# EAGLE design RasPi-feather (EAGLE 8.4.0)
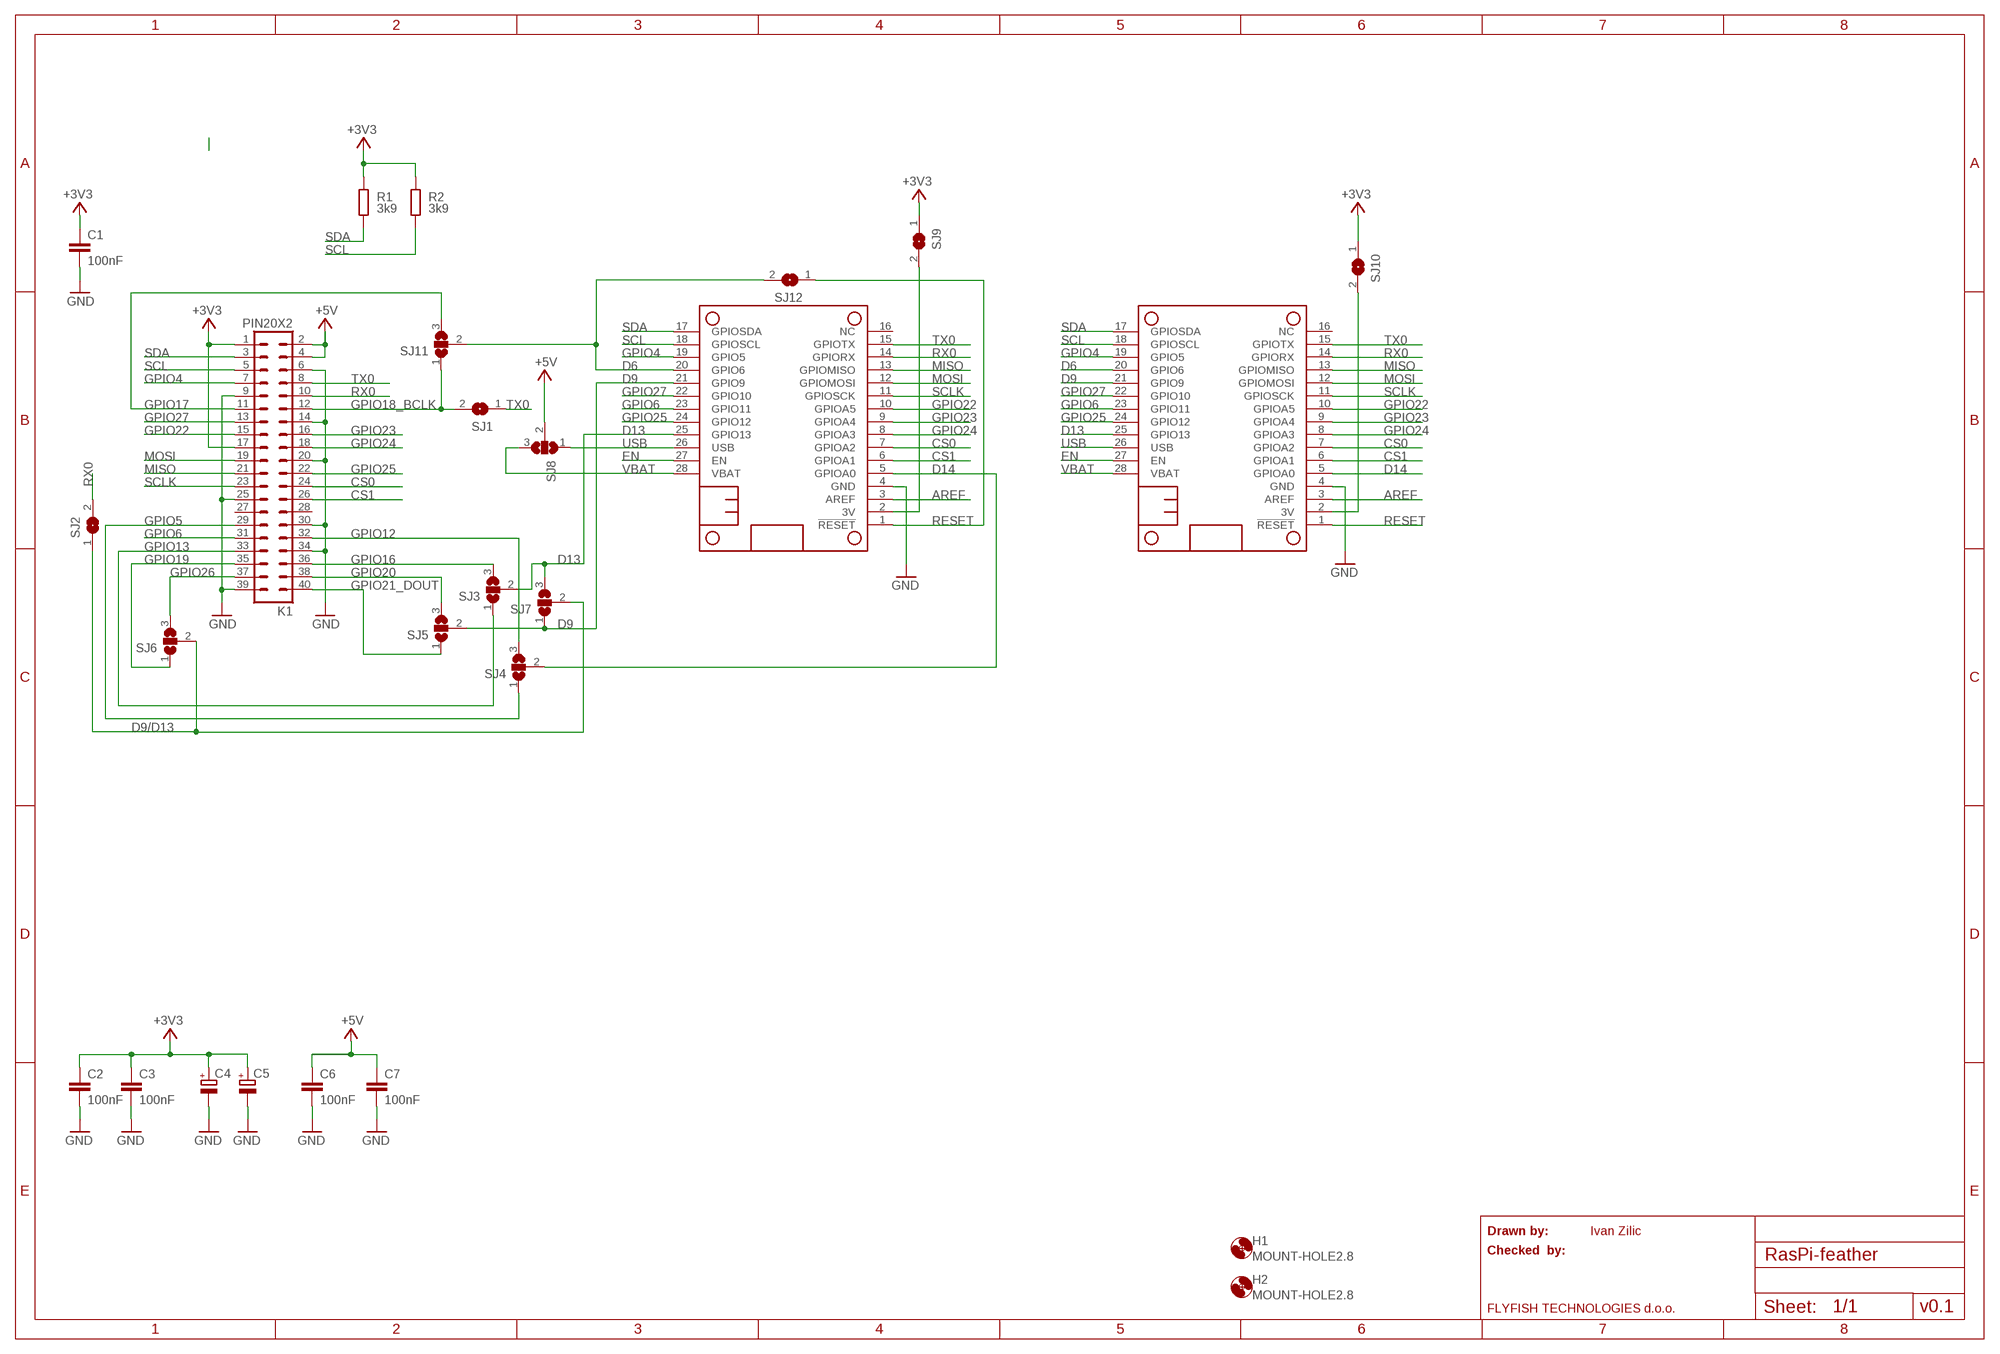
[diagram p0: schematic, sheet 1]

## Parts
C1  100nF  C-EUC0805K  [C0805K]
C2  100nF  C-EUC0805K  [C0805K]
C3  100nF  C-EUC0805K  [C0805K]
C4  CPOL-EUSMCD  [SMC_D]
C5  CPOL-EUSMCD  [SMC_D]
C6  100nF  C-EUC0805K  [C0805K]
C7  100nF  C-EUC0805K  [C0805K]
H1  MOUNT-HOLE2.8  [2,8]
H2  MOUNT-HOLE2.8  [2,8]
K1  PIN20X2  [PIN_20X2]
MS1  FEATHERWING_NODIM  [FEATHERWING_DIM]
MS2  FEATHERWING_NODIM  [FEATHERWING_DIM]
R1  3k9  R-EU_M0805  [M0805]
R2  3k9  R-EU_M0805  [M0805]
SJ1  SJ  [SJ]
SJ2  SJ  [SJ]
SJ3  SJ2W  [SJ_2]
SJ4  SJ2W  [SJ_2]
SJ5  SJ2W  [SJ_2]
SJ6  SJ2W  [SJ_2]
SJ7  SJ2W  [SJ_2]
SJ8  SJ2W  [SJ_2]
SJ9  SJ  [SJ]
SJ10  SJ  [SJ]
SJ11  SJ2W  [SJ_2]
SJ12  SJ  [SJ]

## Nets
3V_1: MS1.2(3V) SJ9.2
3V_2: MS2.2(3V) SJ10.2
+3V3: C1.1 C2.1 C3.1 C4.+ C5.+ K1.1 K1.17 R1.2 R2.2 SJ9.1 SJ10.1
+5V: C6.1 C7.1 K1.2 K1.4 SJ8.2
AREF: MS1.3(AREF) MS2.3(AREF)
CS0: K1.24 MS1.7(GPIOA2) MS2.7(GPIOA2)
CS1: K1.26 MS1.6(GPIOA1) MS2.6(GPIOA1)
D6: MS1.20(GPIO6) MS2.20(GPIO6) SJ11.2 SJ12.2
D9: MS1.21(GPIO9) MS2.21(GPIO9) SJ5.2 SJ7.1
D9/D13: SJ2.1 SJ6.2 SJ7.2
D13: MS1.25(GPIO13) MS2.25(GPIO13) SJ3.2 SJ7.3
D14: MS1.5(GPIOA0) MS2.5(GPIOA0) SJ4.2
EN: MS1.27(EN) MS2.27(EN)
GND: C1.2 C2.2 C3.2 C4.- C5.- C6.2 C7.2 K1.6 K1.9 K1.14 K1.20 K1.25 K1.30 K1.34 K1.39 MS1.4(GND) MS2.4(GND)
GPIO4: K1.7 MS1.19(GPIO5) MS2.19(GPIO5)
GPIO5: K1.29 SJ4.1
GPIO6: K1.31 MS1.23(GPIO11) MS2.23(GPIO11)
GPIO12: K1.32 SJ4.3
GPIO13: K1.33 SJ3.1
GPIO16: K1.36 SJ3.3
GPIO17: K1.11 SJ11.3
GPIO18_BCLK: K1.12 SJ1.2 SJ11.1
GPIO19: K1.35 SJ6.1
GPIO20: K1.38 SJ5.3
GPIO21_DOUT: K1.40 SJ5.1
GPIO22: K1.15 MS1.10(GPIOA5) MS2.10(GPIOA5)
GPIO23: K1.16 MS1.9(GPIOA4) MS2.9(GPIOA4)
GPIO24: K1.18 MS1.8(GPIOA3) MS2.8(GPIOA3)
GPIO25: K1.22 MS1.24(GPIO12) MS2.24(GPIO12)
GPIO26: K1.37 SJ6.3
GPIO27: K1.13 MS1.22(GPIO10) MS2.22(GPIO10)
MISO: K1.21 MS1.13(GPIOMISO) MS2.13(GPIOMISO)
MOSI: K1.19 MS1.12(GPIOMOSI) MS2.12(GPIOMOSI)
RESET: MS1.1(!RESET) MS2.1(!RESET) SJ12.1
RX0: K1.10 MS1.14(GPIORX) MS2.14(GPIORX) SJ2.2
SCL: K1.5 MS1.18(GPIOSCL) MS2.18(GPIOSCL) R2.1
SCLK: K1.23 MS1.11(GPIOSCK) MS2.11(GPIOSCK)
SDA: K1.3 MS1.17(GPIOSDA) MS2.17(GPIOSDA) R1.1
TX0: K1.8 MS1.15(GPIOTX) MS2.15(GPIOTX) SJ1.1
USB: MS1.26(USB) MS2.26(USB) SJ8.1
VBAT: MS1.28(VBAT) MS2.28(VBAT) SJ8.3
Unconnected: K1.27 K1.28 MS1.16(NC) MS2.16(NC)

## Notes on the sheet
- Drawn by: | Ivan Zilic
- Checked  by:
- FLYFISH TECHNOLOGIES d.o.o. | v0.1

## Library data of the parts
C1-C3 C6 C7 = resistor:C-EU: CAPACITOR, European symbol; DIELECTRIC: X7R
C4 C5 = rcl:CPOL-EU: POLARIZED CAPACITOR, European symbol
H1 H2 = holes:MOUNT-HOLE: MOUNTING HOLE with drill center marker
K1 = FLYFISH:PIN20X2
MS1 MS2 = adafruit:FEATHERWING
R1 R2 = resistor:R-EU_: RESISTOR, European symbol; TOLERANCE: 5%
SJ1 SJ2 SJ9 SJ10 SJ12 = jumper:SJ: SMD solder JUMPER
SJ3-SJ8 SJ11 = jumper:SJ2W: SMD solder JUMPER

## Board
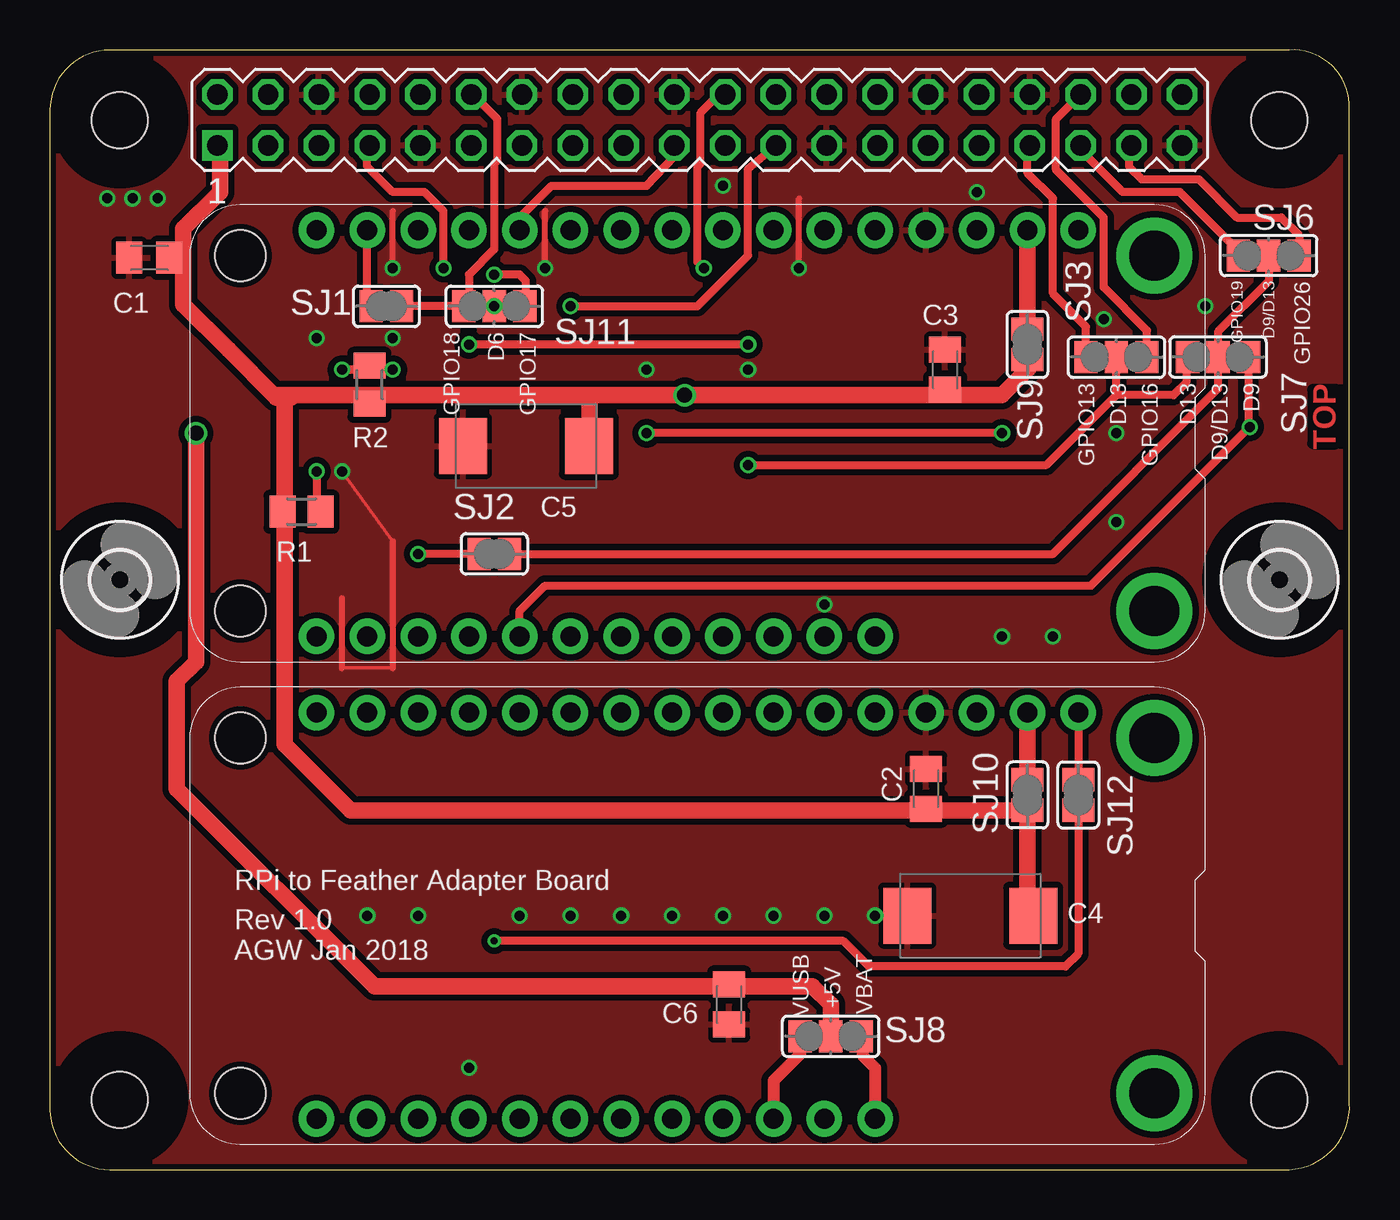
[diagram p1: board, top side]
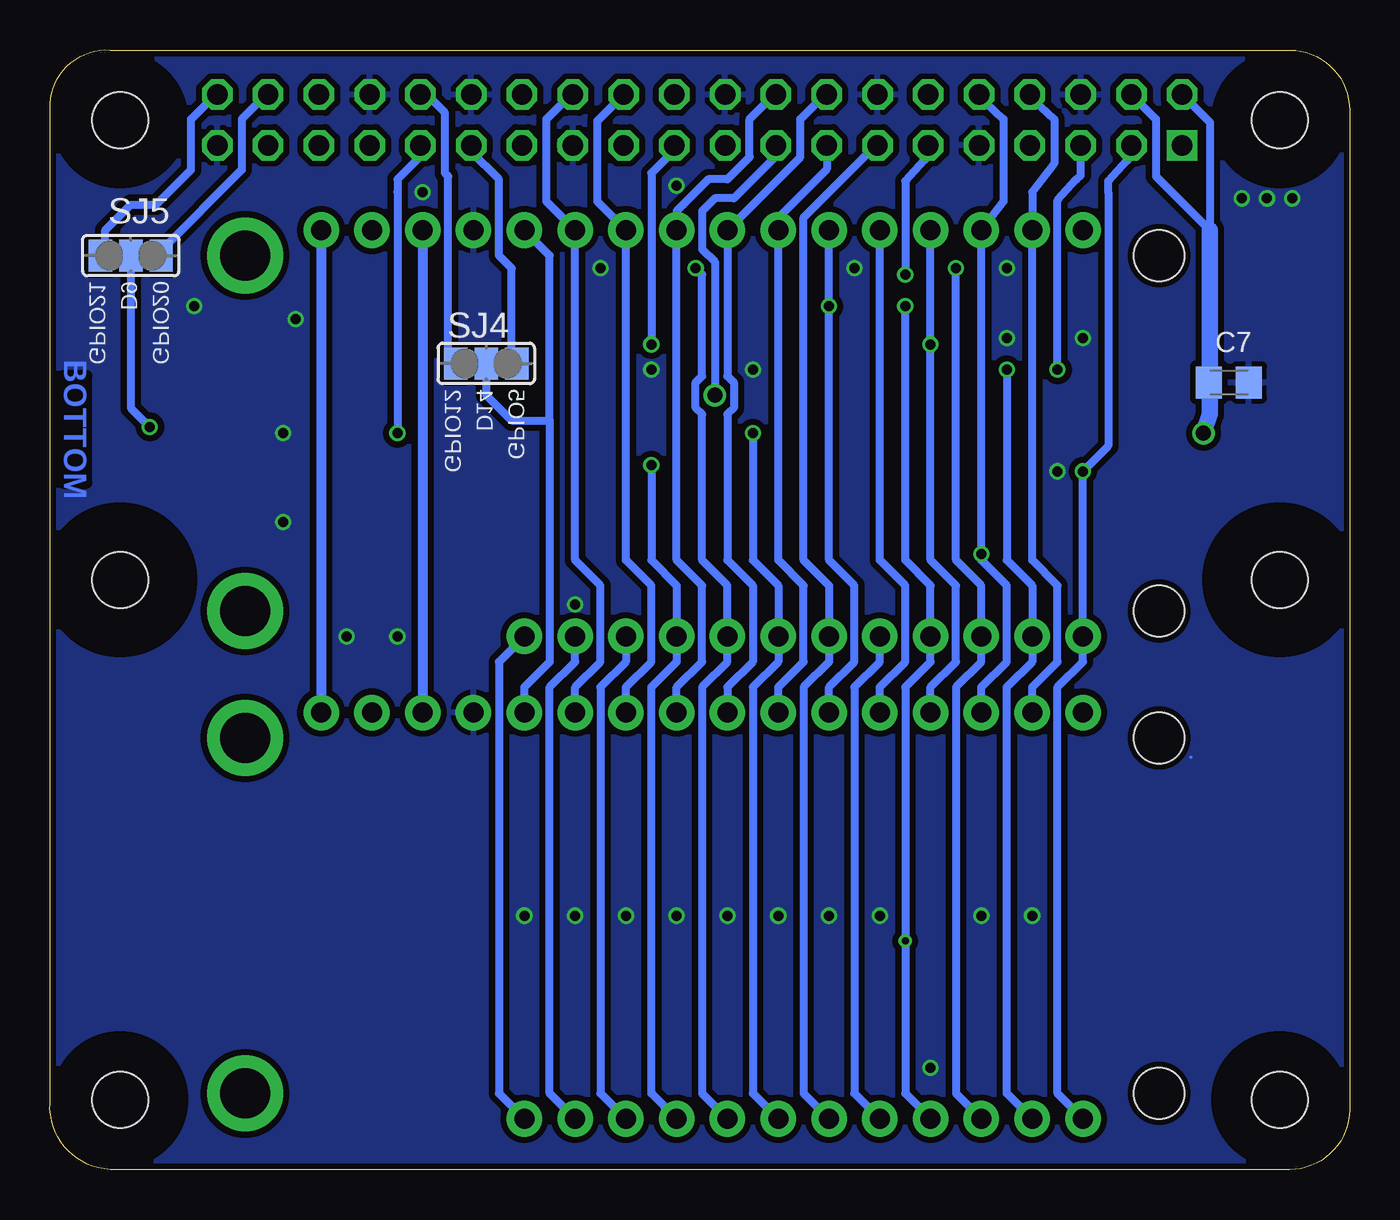
[diagram p2: board, bottom side, seen from below]

Size 65 x 56 mm. Coordinates in mm from the lower left corner, seen from the top.
Outline: 0,3 arc90 3,0 62,0 arc90 65,3.32 65,53.32 arc90 62,56 3,56 arc90 0,53 0,3
Copper layers (1*16): Top 0.035mm / dielectric 1.5mm / Bottom 0.035mm
Design rules "ITEADstudio_DRC": minimum track width 6mil, minimum drill 12mil, track to track 6mil, track to pad 6mil, pad to pad 6mil, via to via 6mil, smd to smd 0mil, copper to edge 10mil, drill to drill 10mil, minimum pad ring 10mil, minimum via ring 6mil, stop-mask expansion 2mil, vias tented up to drill 100mil, thermal gap 10mil
Holes 2.8 mm at 3.5,3.5 3.5,52.5 61.5,52.5 61.5,3.5
tRestrict: area 1.9,51 to 5,54; area 60,51 to 63,54; area 60,1.9 to 63,5; area 1.9,1.9 to 5,5
bRestrict: area 1.9,1.9 to 5,5; area 1.9,51 to 5,54; area 60,1.9 to 63,5; area 60,51 to 63,54

### Footprints (pad centres in the part's own frame; a part is rotated, then mirrored left to right if it is on the bottom)
C0805K = smd 1.3 x 1.6: 1 -1,0; 2 1,0
SMC_D = smd 2.4 x 2.8: + -3.15,0; - 3.15,0
2,8 = hole 2.8: 0,0
PIN_20X2 = drill 1.016 square: 1 -24.13,-1.27 | drill 1.016 octagon: 2 -24.13,1.27; 3 -21.59,-1.27; 4 -21.59,1.27; 5 -19.05,-1.27; 6 -19.05,1.27; 7 -16.51,-1.27; 8 -16.51,1.27; 9 -13.97,-1.27; 10 -13.97,1.27; 11 -11.43,-1.27; 12 -11.43,1.27; 13 -8.89,-1.27; 14 -8.89,1.27; 15 -6.35,-1.27; 16 -6.35,1.27; 17 -3.81,-1.27; 18 -3.81,1.27; 19 -1.27,-1.27; 20 -1.27,1.27; 21 1.27,-1.27; 22 1.27,1.27; 23 3.81,-1.27; 24 3.81,1.27; 25 6.35,-1.27; 26 6.35,1.27; 27 8.89,-1.27; 28 8.89,1.27; 29 11.43,-1.27; 30 11.43,1.27; 31 13.97,-1.27; 32 13.97,1.27; 33 16.51,-1.27; 34 16.51,1.27; 35 19.05,-1.27; 36 19.05,1.27; 37 21.59,-1.27; 38 21.59,1.27; 39 24.13,-1.27; 40 24.13,1.27
FEATHERWING_DIM = drill 1 pad 1.778: 1 6.35,1.27; 2 8.89,1.27; 3 11.43,1.27; 4 13.97,1.27; 5 16.51,1.27; 6 19.05,1.27; 7 21.59,1.27; 8 24.13,1.27; 9 26.67,1.27; 10 29.21,1.27; 11 31.75,1.27; 12 34.29,1.27; 13 36.83,1.27; 14 39.37,1.27; 15 41.91,1.27; 16 44.45,1.27; 17 44.45,21.59; 18 41.91,21.59; 19 39.37,21.59; 20 36.83,21.59; 21 34.29,21.59; 22 31.75,21.59; 23 29.21,21.59; 24 26.67,21.59; 25 24.13,21.59; 26 21.59,21.59; 27 19.05,21.59; 28 16.51,21.59 | drill 2.5 pad 3.81: P$1 2.54,20.32; P$2 2.54,2.54 | hole 2.54: 48.26,20.32; 48.26,2.54
M0805 = smd 1.3 x 1.6: 1 -0.95,0; 2 0.95,0
SJ = smd 1.168 x 1.6: 1 -0.762,0; 2 0.762,0
SJ_2 = smd 1.168 x 1.6: 1 -1.524,0; 2 0,0; 3 1.524,0

### Placement (x,y rotation side)
C1  4.96,45.61 180 top
C2  43.81,19.05 90 top
C3  44.77,40.01 90 top
C4  46.04,12.7 180 top
C5  23.81,36.2 180 top
C6  33.97,8.26 270 top
C7  6.03,39.37 0 bottom
H1  3.5,29.5 0 top
H2  61.5,29.5 0 top
K1  32.5,52.5 0 top
MS1  57.78,48.26 180 top
MS2  57.78,24.13 180 top
R1  12.59,32.91 180 top
R2  15.99,39.26 270 top
SJ1  16.83,43.18 0 top
SJ2  22.23,30.8 180 top
SJ3  53.34,40.64 0 top
SJ4  43.18,40.32 180 bottom
SJ5  60.96,45.72 0 bottom
SJ6  60.96,45.72 0 top
SJ7  58.42,40.64 180 top
SJ8  39.05,6.67 0 top
SJ9  48.9,41.27 90 top
SJ10  48.9,18.73 90 top
SJ11  22.23,43.18 0 top
SJ12  51.44,18.73 270 top

### Tracks (layer width: path | path; a pad name or v marks a point on that pad's centre or on a via)
3V_1
  Top 0.813: MS1.2 SJ9.2
3V_2
  Top 0.813: SJ10.2 MS2.2
+3V3  (via drill 0.75)
  Top 0.152: 48.9,16.54 C4.+ | K1.1 8.51,51.09 | C1.1 6.87,45.61 6.67,45.72 | 11.32,38.62 11.43,38.73 11.54,38.85 15.88,38.73 15.99,38.62 R2.2 | 9.1,41.16 8.94,41 | v31.75,38.73 31.43,38.73 | C5.+ 26.99,36.22 | 11.75,38.3 12.06,38.62 | R1.2 11.75,33.02 | 48.9,40.1 48.94,40.05 | C3.1 44.77,38.73 | C2.1 43.81,17.97
  Top 0.813: 48.9,13.34 48.9,16.54 SJ10.1 43.81,17.97 15.05,17.97 11.75,21.27 11.75,33.02 11.75,38.3 | 48.9,40.64 SJ9.1 48.9,40.1 | 8.51,51.09 8.51,48.9 6.67,47.06 6.67,45.72 6.67,43.27 8.94,41 11.32,38.62 12.06,38.62 | 48.94,40.05 47.62,38.73 44.77,38.73 31.43,38.73 26.99,38.73 | 26.99,38.73 11.43,38.73 | 26.99,36.22 26.99,38.73
  Bottom 0.406: K1.17 28.69,50.69 30.8,48.58 31.75,48.58 32.38,47.94 32.38,46.04 31.75,45.4 v31.75,38.73
+5V  (via drill 0.75)
  Top 0.152: 33.97,9.21 33.97,9.16
  Top 0.813: 33.97,9.21 C6.1 | SJ8.2 39.05,8.26 38.15,9.16 33.97,9.16 16.24,9.16 6.35,19.05 6.35,24.45 7.3,25.4 v7.3,36.83
  Bottom 0.152: C7.1 6.99,39.32 6.99,39.05
  Bottom 0.406: K1.2 6.99,52.38 6.99,46.99 9.68,49.69 9.68,52.54 K1.4
  Bottom 0.813: 6.99,46.99 6.99,39.05 6.99,37.78 v7.3,36.83
AREF
  Bottom 0.508: MS1.3 MS2.3
CS0
  Bottom 0.406: K1.24 37.62,52.46 37.62,48.42 MS1.7 36.2,30.48 34.92,29.21 34.92,25.4 36.2,24.13 MS2.7
CS1
  Bottom 0.406: MS2.6 38.73,24.13 37.47,25.4 37.47,29.21 38.73,30.48 MS1.6 40.16,48.42 40.16,52.55 38.94,53.77 K1.26
D6  (via drill 0.35, 0.5)
  Top 0.406: SJ12.2 51.44,10.79 50.8,10.16 40.96,10.16 39.69,11.43 v22.23,11.43
  Bottom 0.406: MS2.20 22.23,3.81 v22.23,11.43 22.23,24.13 20.95,25.4 MS1.20 20.95,29.21 22.23,30.48 SJ11.2
  other vias: 22.23,43.18
D9  (via drill 0.5)
  Top 0.406: MS1.21 23.5,27.94 24.77,29.21 52.07,29.21 59.94,37.08 | SJ7.1 59.94,37.08 | 59.94,37.08 v60.01,37.15
  Bottom 0.406: SJ5.2 60.96,38.1 v60.01,37.15 | MS2.21 24.77,3.81 24.77,24.13 23.5,25.4 MS1.21
D9/D13
  Top 0.406: SJ2.1 50.16,30.8 58.42,39.05 SJ7.2 58.42,41.91 60.96,44.45 SJ6.2
D13  (via drill 0.5)
  Top 0.152: SJ7.3 56.83,40.58
  Top 0.406: v34.92,35.24 49.85,35.24 53.34,38.73 | 53.34,38.73 SJ3.2 | 56.83,40.58 56.83,39.37 56.2,38.73 53.34,38.73
  Bottom 0.406: MS2.25 34.92,3.81 34.92,24.13 33.66,25.4 MS1.25 33.66,29.21 34.92,30.48 v34.92,35.24
D14
  Bottom 0.406: MS2.5 41.27,24.13 40.01,25.4 40.01,37.47 | MS1.5 40.01,45.72 40.01,37.47 | SJ4.2 43.18,38.73 41.91,37.47 40.01,37.47
EN
  Bottom 0.406: MS2.27 40.01,3.81 40.01,24.13 38.73,25.4 MS1.27
GND  (via drill 0.5)
  Top 0.152: v14.61,34.92 17.14,31.43 | 17.14,25.08 14.61,25.08
  Top 0.305: v24.77,45.09 24.77,47.94 | v37.47,45.09 37.47,48.58 | v17.14,45.09 17.14,47.94 | 14.61,25.08 14.61,28.57 | 17.14,31.43 17.14,25.08
  Bottom 0.152: 7.95,20.63 7.94,20.64
  other vias: 47.62,26.67 50.16,26.67 15.88,12.7 18.41,12.7 23.5,12.7 26.04,12.7 28.57,12.7 31.11,12.7 33.66,12.7 36.2,12.7 38.73,12.7 41.27,12.7 29.84,40.01 34.92,40.01 57.78,43.18 46.35,48.9 33.66,49.21 52.7,42.55 20.95,5.08 17.14,41.59 38.73,28.26 5.4,48.58 4.13,48.58 2.86,48.58 13.34,41.59 53.34,36.83 53.34,32.38
  pour Bottom (isolate 0.305): 0,3 arc90 3,0 62,0 arc90 65,3 65,53 arc90 62,56 3,56 arc90 0,53 0,18.5
  pour Top (isolate 0.305): -1.91,56.52 66.04,56.52 66.04,1.27 64.14,-0.64 1.91,-0.64 -1.91,3.17
GPIO4  (via drill 0.5)
  Top 0.152: 15.88,50.8 15.99,50.91
  Top 0.406: v19.68,45.09 19.68,47.94 18.73,48.9 17.14,48.9 15.88,50.16 15.88,50.8 | 15.99,50.91 K1.7
  Bottom 0.406: MS2.19 19.68,3.81 19.68,24.13 18.41,25.4 MS1.19 18.41,29.21 19.68,30.48 v19.68,45.09
GPIO5
  Bottom 0.152: SJ4.1 41.91,40.58 | 43.93,50.91 K1.29
  Bottom 0.406: 41.91,40.58 41.91,45.09 42.55,45.72 42.55,49.53 43.93,50.91
GPIO6  (via drill 0.5)
  Top 0.406: v47.62,36.83 v29.84,36.83
  Bottom 0.406: MS2.23 29.84,3.81 29.84,24.13 28.57,25.4 MS1.23 28.57,29.21 29.84,30.48 v29.84,36.83 | v47.62,36.83 47.62,48.9 47.62,49.53 46.47,50.69 K1.31
GPIO12
  Bottom 0.152: SJ4.3 45.09,40.7
  Bottom 0.406: K1.32 46.15,53.77 45.24,52.86 45.24,49.85 45.09,49.69 45.09,40.7
GPIO13
  Top 0.152: 48.9,51.12 K1.33
  Top 0.406: SJ3.1 51.82,42.16 50.16,43.81 50.16,48.58 48.9,49.85 48.9,51.12
GPIO16
  Top 0.406: SJ3.3 54.86,41.97 52.7,44.13 52.7,47.62 50.32,50.01 50.32,52.54 K1.36
GPIO17  (via drill 0.5)
  Top 0.152: SJ11.3 23.81,43.81
  Top 0.406: 23.81,43.81 23.81,44.45 23.5,44.77 v22.23,44.77
  Bottom 0.406: K1.11 21.07,50.69 21.27,50.48 22.23,49.44 v22.23,44.77
GPIO18_BCLK
  Top 0.152: 21.16,53.77 K1.12 | 20.64,43.5 SJ11.1 20.95,43.81
  Top 0.406: 20.64,43.5 20.64,43.18 SJ1.2 | 21.16,53.77 22.38,52.55 22.38,50.48 22.23,50.32 22.23,46.04 20.95,44.77 20.95,43.81
GPIO19
  Top 0.152: SJ6.1 59.44,46.1 59.69,46.35 59.69,45.72
  Top 0.406: 59.69,45.72 56.52,48.9 53.66,48.9 51.55,51 K1.35
GPIO20
  Bottom 0.152: K1.38 54.18,53.77
  Bottom 0.406: 54.18,53.77 55.4,52.55 55.4,50.01 59.44,45.97 SJ5.3
GPIO21_DOUT
  Bottom 0.152: SJ5.1 62.23,45.97 | 56.72,53.77 K1.40
  Bottom 0.406: 62.23,45.97 62.23,46.99 60.96,48.26 59.69,48.26 57.94,50.01 57.94,52.55 56.72,53.77
GPIO22
  Bottom 0.406: MS2.10 28.57,24.13 27.3,25.4 27.3,29.21 28.57,30.48 MS1.10 28.57,47.62 26.15,50.05 K1.15
GPIO23
  Bottom 0.152: 26.24,53.77 K1.16
  Bottom 0.406: MS2.9 31.11,24.13 29.84,25.4 29.84,29.21 31.11,30.48 31.11,37.78 30.8,38.1 30.8,39.37 31.11,39.69 MS1.9 27.46,50.64 27.46,52.55 26.24,53.77
GPIO24
  Bottom 0.152: 28.78,53.77 K1.18
  Bottom 0.406: MS2.8 33.66,24.13 32.38,25.4 32.38,29.21 33.66,30.48 MS1.8 33.66,47.62 33.66,47.94 33.34,48.26 32.07,49.53 31.11,49.53 30,50.64 30,52.55 28.78,53.77
GPIO25  (via drill 0.5)
  Top 0.406: v32.7,45.09 32.38,45.4 32.38,50.16 32.54,50.32 32.54,52.86 33.45,53.77 K1.22
  Bottom 0.406: MS2.24 32.38,3.81 32.38,24.13 31.11,25.4 MS1.24 31.11,29.21 32.38,30.48 32.38,37.78 32.7,38.1 32.7,39.37 32.38,39.69 32.38,44.77 v32.7,45.09
GPIO26
  Top 0.152: K1.37 53.98,51.12
  Top 0.406: 53.98,51.12 53.98,50.16 54.61,49.53 57.47,49.53 59.37,47.62 61.59,47.62 62.48,46.74 SJ6.3
GPIO27
  Bottom 0.152: 23.7,51.23 K1.13
  Bottom 0.406: 23.7,51.23 27.3,47.62 27.3,30.48 26.04,29.21 MS1.22 26.04,25.4 27.3,24.13 27.3,3.81 MS2.22
MISO  (via drill 0.5)
  Top 0.406: v34.92,41.27 v20.95,41.27
  Bottom 0.406: MS2.13 20.95,24.13 19.68,25.4 19.68,29.21 20.95,30.48 v20.95,41.27 MS1.13 | K1.21 33.97,50.8 34.92,49.85 v34.92,41.27
MOSI
  Top 0.406: MS1.12 23.5,47.62 25.08,49.21 29.84,49.21 31.23,50.69 K1.19
  Bottom 0.406: MS2.12 23.5,24.13 22.23,25.4 22.23,29.21 23.5,30.48 MS1.12
RESET
  Top 0.406: MS2.1 SJ12.1
  Bottom 0.508: MS1.1 MS2.1
RX0  (via drill 0.5)
  Top 0.406: SJ2.2 v18.41,30.8
  Bottom 0.152: K1.10 18.62,53.77
  Bottom 0.406: MS2.14 18.41,24.13 17.14,25.4 17.14,29.21 18.41,30.48 v18.41,30.8 MS1.14 17.3,48.42 17.3,52.55 18.62,53.77
SCL  (via drill 0.5)
  Top 0.406: v17.14,40.01 v14.61,40.01 15.88,40.01 15.99,40.12 R2.1
  Bottom 0.152: K1.5 13.34,51.12
  Bottom 0.406: MS2.18 17.14,3.81 17.14,24.13 15.88,25.4 MS1.18 15.88,29.21 17.14,30.48 v17.14,40.01 | v14.61,40.01 14.61,48.49 13.65,49.53 13.45,49.73 K1.5
SCLK  (via drill 0.5)
  Top 0.406: K1.23 34.92,50.08 34.92,45.72 32.38,43.18 v26.04,43.18
  Bottom 0.406: MS2.11 26.04,24.13 24.77,25.4 24.77,29.21 26.04,30.48 v26.04,43.18 MS1.11
SDA  (via drill 0.5)
  Top 0.152: 13.34,33.11 R1.1
  Top 0.406: v13.34,34.92 13.34,33.11
  Bottom 0.152: K1.3 10.79,51.12 | 11.95,49.01 12.06,48.9
  Bottom 0.406: MS2.17 14.61,3.81 14.61,24.13 13.34,25.4 MS1.17 v13.34,34.92 12.06,36.2 12.06,48.9 12.06,49.44 11.11,50.48 10.91,50.69 K1.3
TX0
  Top 0.152: SJ1.1 16.07,43.62 15.88,43.81
  Top 0.406: 15.88,42.86 SJ1.1 | 15.88,43.81 MS1.15
  Bottom 0.152: K1.8 16.08,53.77
  Bottom 0.406: MS2.15 15.88,24.13 14.61,25.4 14.61,29.21 15.88,30.48 MS1.15 15.88,48.9 14.76,50.32 14.76,52.55 16.08,53.77
USB
  Top 0.61: SJ8.1 37.53,5.78 36.2,4.45 MS2.26
  Bottom 0.406: MS1.26 36.2,25.4 37.47,24.13 37.47,3.81 MS2.26
VBAT
  Top 0.152: SJ8.3 40.64,6.6
  Top 0.61: 40.64,6.6 40.64,5.71 41.27,5.08 MS2.28
  Bottom 0.406: MS1.28 42.55,25.4 42.55,3.81 MS2.28

### Text on the board
Top: TOP
Bottom: BOTTOM
tNames: GPIO19 | D9/D13 | GPIO26 | GPIO18 | D6 | GPIO17 | GPIO13 | D13 | GPIO16 | D13 | D9/D13 | D9 | RPi to Feather Adapter Board | VUSB | VBAT | Rev 1.0 / AGW Jan 2018 | +5V
bNames: GPIO20 | D9 | GPIO21 | GPIO5 | D14 | GPIO12